# Altium schematic sheet AFE_32.SchDoc: FMC ADC 128CH 10B
size 420 x 297 mm; Author: G.Kasprowicz; CompanyName: WUT ISE; DrawnBy: G.Kasprowicz; Organization: WUT ISE; Address1: PW ISE; Address2: Nowowiejska 15/19 00-665 Warsaw; Address3: gkasprow@gmail.com; DocumentNumber: 2; Revision: 1; SheetNumber: 2; SheetTotal: 9; ModifiedBy: -; CheckedDate: -; Title2: AFE 32CH; DivGrp: WUT ISE; Designer: G.Kasprowicz; ModifiedDate: -; ProjectName: Sensor Box
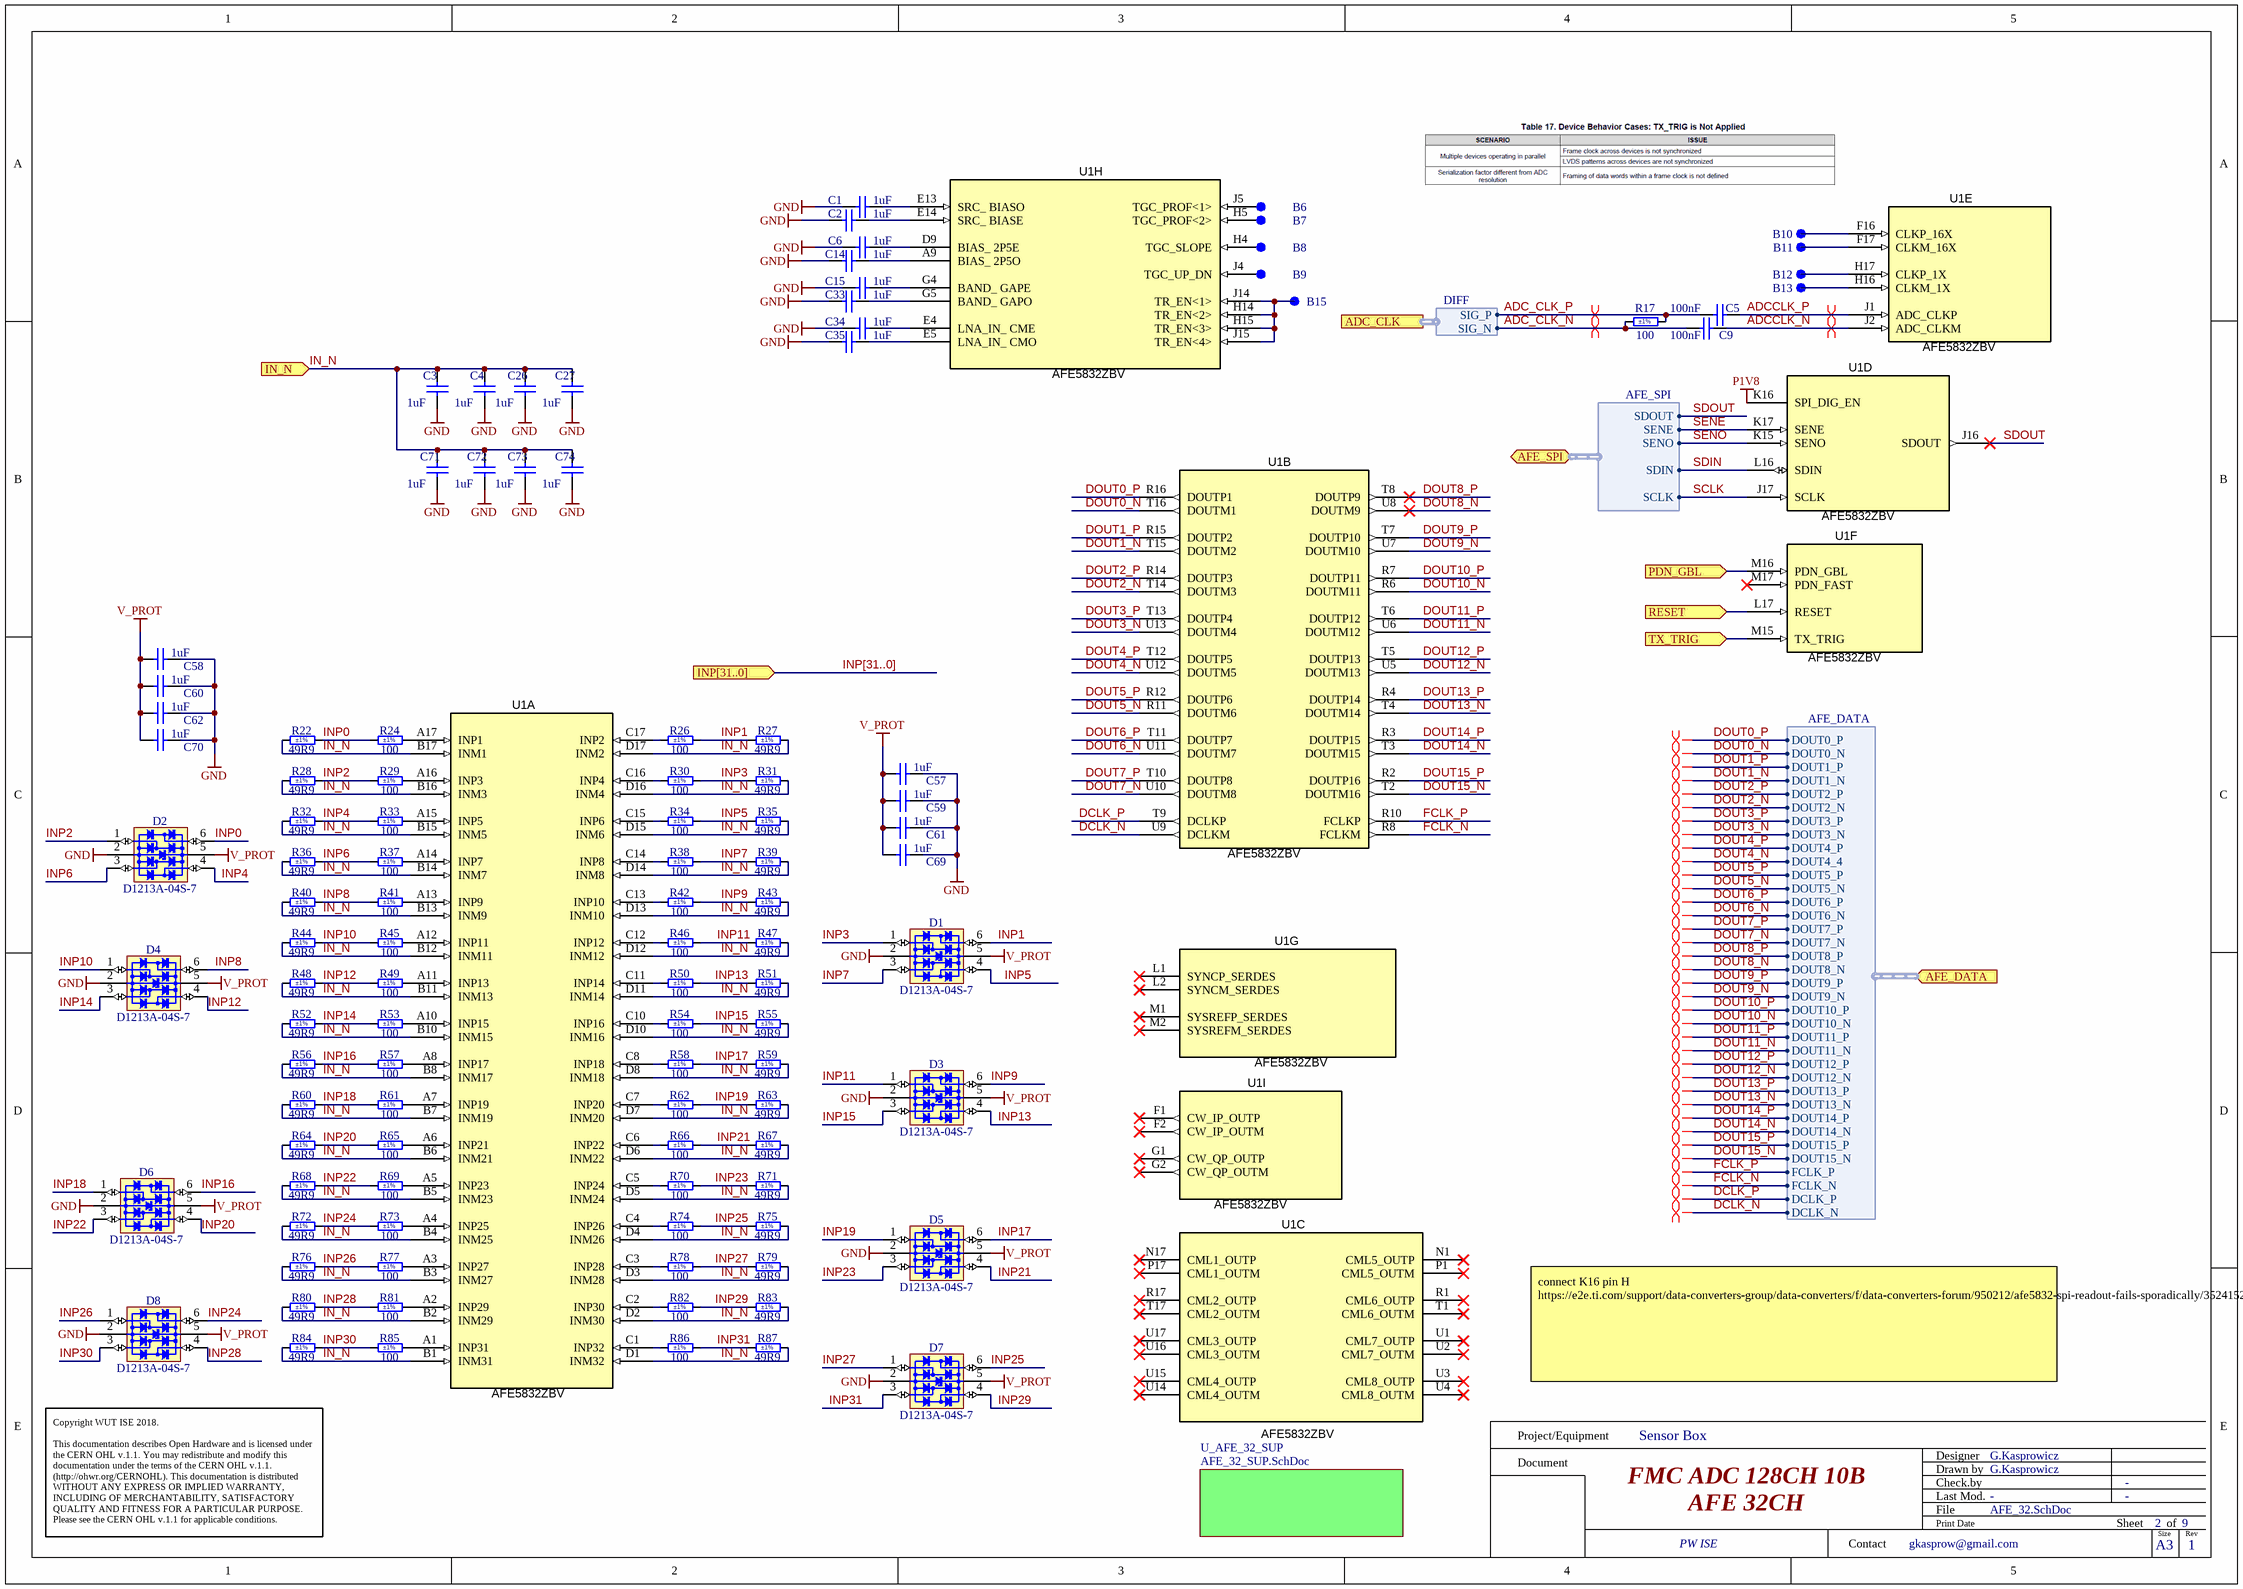
[diagram p0: AFE_32.SchDoc]

## Parts
B6  SMD Pad  [C75]  (value not drawn)  (no BOM)
B7  SMD Pad  [C75]  (value not drawn)  (no BOM)
B8  SMD Pad  [C75]  (value not drawn)  (no BOM)
B9  SMD Pad  [C75]  (value not drawn)  (no BOM)
B10  SMD Pad  [C75]  (value not drawn)  (no BOM)
B11  SMD Pad  [C75]  (value not drawn)  (no BOM)
B12  SMD Pad  [C75]  (value not drawn)  (no BOM)
B13  SMD Pad  [C75]  (value not drawn)  (no BOM)
B15  SMD Pad  [C75]  (value not drawn)  (no BOM)
C1  1uF  [CAPC1005X55N]
C2  1uF  [CAPC1005X55N]
C3  1uF  [CAPC1005X55N]
C4  1uF  [CAPC1005X55N]
C5  100nF  [CAPC0603X33N]
C6  1uF  [CAPC1005X55N]
C9  100nF  [CAPC0603X33N]
C14  1uF  [CAPC1005X55N]
C15  1uF  [CAPC1005X55N]
C26  1uF  [CAPC1005X55N]
C27  1uF  [CAPC1005X55N]
C33  1uF  [CAPC1005X55N]
C34  1uF  [CAPC1005X55N]
C35  1uF  [CAPC1005X55N]
C57  1uF  [CAPC1005X55N]
C58  1uF  [CAPC1005X55N]
C59  1uF  [CAPC1005X55N]
C60  1uF  [CAPC1005X55N]
C61  1uF  [CAPC1005X55N]
C62  1uF  [CAPC1005X55N]
C69  1uF  [CAPC1005X55N]
C70  1uF  [CAPC1005X55N]
C71  1uF  [CAPC1005X55N]
C72  1uF  [CAPC1005X55N]
C73  1uF  [CAPC1005X55N]
C74  1uF  [CAPC1005X55N]
D1  D1213A-04S-7  [SOT65P210X110-6N]
D2  D1213A-04S-7  [SOT65P210X110-6N]
D3  D1213A-04S-7  [SOT65P210X110-6N]
D4  D1213A-04S-7  [SOT65P210X110-6N]
D5  D1213A-04S-7  [SOT65P210X110-6N]
D6  D1213A-04S-7  [SOT65P210X110-6N]
D7  D1213A-04S-7  [SOT65P210X110-6N]
D8  D1213A-04S-7  [SOT65P210X110-6N]
R17  100  Tolerance: ±1%  [RESC1005X40N]
R22  49R9  Tolerance: ±1%  [RESC0603X28N]
R24  100  Tolerance: ±1%  [RESC0603X28N]
R26  100  Tolerance: ±1%  [RESC0603X28N]
R27  49R9  Tolerance: ±1%  [RESC0603X28N]
R28  49R9  Tolerance: ±1%  [RESC0603X28N]
R29  100  Tolerance: ±1%  [RESC0603X28N]
R30  100  Tolerance: ±1%  [RESC0603X28N]
R31  49R9  Tolerance: ±1%  [RESC0603X28N]
R32  49R9  Tolerance: ±1%  [RESC0603X28N]
R33  100  Tolerance: ±1%  [RESC0603X28N]
R34  100  Tolerance: ±1%  [RESC0603X28N]
R35  49R9  Tolerance: ±1%  [RESC0603X28N]
R36  49R9  Tolerance: ±1%  [RESC0603X28N]
R37  100  Tolerance: ±1%  [RESC0603X28N]
R38  100  Tolerance: ±1%  [RESC0603X28N]
R39  49R9  Tolerance: ±1%  [RESC0603X28N]
R40  49R9  Tolerance: ±1%  [RESC0603X28N]
R41  100  Tolerance: ±1%  [RESC0603X28N]
R42  100  Tolerance: ±1%  [RESC0603X28N]
R43  49R9  Tolerance: ±1%  [RESC0603X28N]
R44  49R9  Tolerance: ±1%  [RESC0603X28N]
R45  100  Tolerance: ±1%  [RESC0603X28N]
R46  100  Tolerance: ±1%  [RESC0603X28N]
R47  49R9  Tolerance: ±1%  [RESC0603X28N]
R48  49R9  Tolerance: ±1%  [RESC0603X28N]
R49  100  Tolerance: ±1%  [RESC0603X28N]
R50  100  Tolerance: ±1%  [RESC0603X28N]
R51  49R9  Tolerance: ±1%  [RESC0603X28N]
R52  49R9  Tolerance: ±1%  [RESC0603X28N]
R53  100  Tolerance: ±1%  [RESC0603X28N]
R54  100  Tolerance: ±1%  [RESC0603X28N]
R55  49R9  Tolerance: ±1%  [RESC0603X28N]
R56  49R9  Tolerance: ±1%  [RESC0603X28N]
R57  100  Tolerance: ±1%  [RESC0603X28N]
R58  100  Tolerance: ±1%  [RESC0603X28N]
R59  49R9  Tolerance: ±1%  [RESC0603X28N]
R60  49R9  Tolerance: ±1%  [RESC0603X28N]
R61  100  Tolerance: ±1%  [RESC0603X28N]
R62  100  Tolerance: ±1%  [RESC0603X28N]
R63  49R9  Tolerance: ±1%  [RESC0603X28N]
R64  49R9  Tolerance: ±1%  [RESC0603X28N]
R65  100  Tolerance: ±1%  [RESC0603X28N]
R66  100  Tolerance: ±1%  [RESC0603X28N]
R67  49R9  Tolerance: ±1%  [RESC0603X28N]
R68  49R9  Tolerance: ±1%  [RESC0603X28N]
R69  100  Tolerance: ±1%  [RESC0603X28N]
R70  100  Tolerance: ±1%  [RESC0603X28N]
R71  49R9  Tolerance: ±1%  [RESC0603X28N]
R72  49R9  Tolerance: ±1%  [RESC0603X28N]
R73  100  Tolerance: ±1%  [RESC0603X28N]
R74  100  Tolerance: ±1%  [RESC0603X28N]
R75  49R9  Tolerance: ±1%  [RESC0603X28N]
R76  49R9  Tolerance: ±1%  [RESC0603X28N]
R77  100  Tolerance: ±1%  [RESC0603X28N]
R78  100  Tolerance: ±1%  [RESC0603X28N]
R79  49R9  Tolerance: ±1%  [RESC0603X28N]
R80  49R9  Tolerance: ±1%  [RESC0603X28N]
R81  100  Tolerance: ±1%  [RESC0603X28N]
R82  100  Tolerance: ±1%  [RESC0603X28N]
R83  49R9  Tolerance: ±1%  [RESC0603X28N]
R84  49R9  Tolerance: ±1%  [RESC0603X28N]
R85  100  Tolerance: ±1%  [RESC0603X28N]
R86  100  Tolerance: ±1%  [RESC0603X28N]
R87  49R9  Tolerance: ±1%  [RESC0603X28N]
U1  AFE5832ZBV  [BGA289C80P17X17_1500X1500X140]  (parts A,B,C,D,E,F,G,H,I of 13)

## Sub-sheets
U_AFE_32_SUP = AFE_32_SUP.SchDoc: no entries

## Ports
ADC_CLK (harness DIFF), AFE_DATA (in, harness AFE_DATA), AFE_SPI (bidir, harness AFE_SPI), IN_N (in), INP[31..0] (in), PDN_GBL (in), RESET (in), TX_TRIG (in)

## Harnesses
AFE_SPI: SDOUT, SENE, SENO, SDIN, SCLK
DIFF: SIG_P, SIG_N
AFE_DATA: DOUT0_P, DOUT0_N, DOUT1_P, DOUT1_N, DOUT2_P, DOUT2_N, DOUT3_P, DOUT3_N, DOUT4_P, DOUT4_4, DOUT5_P, DOUT5_N, DOUT6_P, DOUT6_N, DOUT7_P, DOUT7_N, DOUT8_P, DOUT8_N, DOUT9_P, DOUT9_N, DOUT10_P, DOUT10_N, DOUT11_P, DOUT11_N, DOUT12_P, DOUT12_N, DOUT13_P, DOUT13_N, DOUT14_P, DOUT14_N, DOUT15_P, DOUT15_N, FCLK_P, FCLK_N, DCLK_P, DCLK_N

## Nets
GND: C1.1 C2.1 C3.2 C4.2 C6.1 C14.1 C15.1 C26.2 C27.2 C33.1 C34.1 C35.1 C57.2 C58.2 C59.2 C60.2 C61.2 C62.2 C69.2 C70.2 C71.2 C72.2 C73.2 C74.2 D1.2(GND) D2.2(GND) D3.2(GND) D4.2(GND) D5.2(GND) D6.2(GND) D7.2(GND) D8.2(GND)
P1V8: U1.K16(SPI_DIG_EN)
V_PROT: C57.1 C58.1 C59.1 C60.1 C61.1 C62.1 C69.1 C70.1 D1.5(VBUS) D2.5(VBUS) D3.5(VBUS) D4.5(VBUS) D5.5(VBUS) D6.5(VBUS) D7.5(VBUS) D8.5(VBUS)
ADC_CLK_N: C9.1 R17.1 ; port ADC_CLK.SIG_N
ADC_CLK_P: C5.1 R17.2 ; port ADC_CLK.SIG_P
ADCCLK_N: C9.2 U1.J2(ADC_CLKM)
ADCCLK_P: C5.2 U1.J1(ADC_CLKP)
DCLK_N: U1.U9(DCLKM) ; port AFE_DATA.DCLK_N
DCLK_P: U1.T9(DCLKP) ; port AFE_DATA.DCLK_P
DOUT0_N: U1.T16(DOUTM1) ; port AFE_DATA.DOUT0_N
DOUT0_P: U1.R16(DOUTP1) ; port AFE_DATA.DOUT0_P
DOUT1_N: U1.T15(DOUTM2) ; port AFE_DATA.DOUT1_N
DOUT1_P: U1.R15(DOUTP2) ; port AFE_DATA.DOUT1_P
DOUT2_N: U1.T14(DOUTM3) ; port AFE_DATA.DOUT2_N
DOUT2_P: U1.R14(DOUTP3) ; port AFE_DATA.DOUT2_P
DOUT3_N: U1.U13(DOUTM4) ; port AFE_DATA.DOUT3_N
DOUT3_P: U1.T13(DOUTP4) ; port AFE_DATA.DOUT3_P
DOUT4_N: U1.U12(DOUTM5) ; port AFE_DATA.DOUT4_4
DOUT4_P: U1.T12(DOUTP5) ; port AFE_DATA.DOUT4_P
DOUT5_N: U1.R11(DOUTM6) ; port AFE_DATA.DOUT5_N
DOUT5_P: U1.R12(DOUTP6) ; port AFE_DATA.DOUT5_P
DOUT6_N: U1.U11(DOUTM7) ; port AFE_DATA.DOUT6_N
DOUT6_P: U1.T11(DOUTP7) ; port AFE_DATA.DOUT6_P
DOUT7_N: U1.U10(DOUTM8) ; port AFE_DATA.DOUT7_N
DOUT7_P: U1.T10(DOUTP8) ; port AFE_DATA.DOUT7_P
DOUT8_N: U1.U8(DOUTM9) ; port AFE_DATA.DOUT8_N
DOUT8_P: U1.T8(DOUTP9) ; port AFE_DATA.DOUT8_P
DOUT9_N: U1.U7(DOUTM10) ; port AFE_DATA.DOUT9_N
DOUT9_P: U1.T7(DOUTP10) ; port AFE_DATA.DOUT9_P
DOUT10_N: U1.R6(DOUTM11) ; port AFE_DATA.DOUT10_N
DOUT10_P: U1.R7(DOUTP11) ; port AFE_DATA.DOUT10_P
DOUT11_N: U1.U6(DOUTM12) ; port AFE_DATA.DOUT11_N
DOUT11_P: U1.T6(DOUTP12) ; port AFE_DATA.DOUT11_P
DOUT12_N: U1.U5(DOUTM13) ; port AFE_DATA.DOUT12_N
DOUT12_P: U1.T5(DOUTP13) ; port AFE_DATA.DOUT12_P
DOUT13_N: U1.T4(DOUTM14) ; port AFE_DATA.DOUT13_N
DOUT13_P: U1.R4(DOUTP14) ; port AFE_DATA.DOUT13_P
DOUT14_N: U1.T3(DOUTM15) ; port AFE_DATA.DOUT14_N
DOUT14_P: U1.R3(DOUTP15) ; port AFE_DATA.DOUT14_P
DOUT15_N: U1.T2(DOUTM16) ; port AFE_DATA.DOUT15_N
DOUT15_P: U1.R2(DOUTP16) ; port AFE_DATA.DOUT15_P
FCLK_N: U1.R8(FCLKM) ; port AFE_DATA.FCLK_N
FCLK_P: U1.R10(FCLKP) ; port AFE_DATA.FCLK_P
IN_N: C3.1 C4.1 C26.1 C27.1 C71.1 C72.1 C73.1 C74.1 R22.2 R27.2 R28.2 R31.2 R32.2 R35.2 R36.2 R39.2 R40.2 R43.2 R44.2 R47.2 R48.2 R51.2 R52.2 R55.2 R56.2 R59.2 R60.2 R63.2 R64.2 R67.2 R68.2 R71.2 R72.2 R75.2 R76.2 R79.2 R80.2 R83.2 R84.2 R87.2 U1.B1(INM31) U1.B2(INM29) U1.B3(INM27) U1.B4(INM25) U1.B5(INM23) U1.B6(INM21) U1.B7(INM19) U1.B8(INM17) U1.B10(INM15) U1.B11(INM13) U1.B12(INM11) U1.B13(INM9) U1.B14(INM7) U1.B15(INM5) U1.B16(INM3) U1.B17(INM1) U1.D1(INM32) U1.D2(INM30) U1.D3(INM28) U1.D4(INM26) U1.D5(INM24) U1.D6(INM22) U1.D7(INM20) U1.D8(INM18) U1.D10(INM16) U1.D11(INM14) U1.D12(INM12) U1.D13(INM10) U1.D14(INM8) U1.D15(INM6) U1.D16(INM4) U1.D17(INM2) ; port IN_N
INP0: D2.6(I/O4) R22.1 R24.1
INP1: D1.6(I/O4) R26.2 R27.1
INP2: D2.1(I/O1) R28.1 R29.1
INP3: D1.1(I/O1) R30.2 R31.1
INP4: D2.4(I/O3) R32.1 R33.1
INP5: D1.4(I/O3) R34.2 R35.1
INP6: D2.3(I/O2) R36.1 R37.1
INP7: D1.3(I/O2) R38.2 R39.1
INP8: D4.6(I/O4) R40.1 R41.1
INP9: D3.6(I/O4) R42.2 R43.1
INP10: D4.1(I/O1) R44.1 R45.1
INP11: D3.1(I/O1) R46.2 R47.1
INP12: D4.4(I/O3) R48.1 R49.1
INP13: D3.4(I/O3) R50.2 R51.1
INP14: D4.3(I/O2) R52.1 R53.1
INP15: D3.3(I/O2) R54.2 R55.1
INP16: D6.6(I/O4) R56.1 R57.1
INP17: D5.6(I/O4) R58.2 R59.1
INP18: D6.1(I/O1) R60.1 R61.1
INP19: D5.1(I/O1) R62.2 R63.1
INP20: D6.4(I/O3) R64.1 R65.1
INP21: D5.4(I/O3) R66.2 R67.1
INP22: D6.3(I/O2) R68.1 R69.1
INP23: D5.3(I/O2) R70.2 R71.1
INP24: D8.6(I/O4) R72.1 R73.1
INP25: D7.6(I/O4) R74.2 R75.1
INP26: D8.1(I/O1) R76.1 R77.1
INP27: D7.1(I/O1) R78.2 R79.1
INP28: D8.4(I/O3) R80.1 R81.1
INP29: D7.4(I/O3) R82.2 R83.1
INP30: D8.3(I/O2) R84.1 R85.1
INP31: D7.3(I/O2) R86.2 R87.1
PDN_GBL: U1.M16(PDN_GBL) ; port PDN_GBL
RESET: U1.L17(RESET) ; port RESET
SCLK: U1.J17(SCLK) ; port AFE_SPI.SCLK
SDIN: U1.L16(SDIN) ; port AFE_SPI.SDIN
SDOUT: U1.J16(SDOUT) ; port AFE_SPI.SDOUT
SENE: U1.K17(SENE) ; port AFE_SPI.SENE
SENO: U1.K15(SENO) ; port AFE_SPI.SENO
TX_TRIG: U1.M15(TX_TRIG) ; port TX_TRIG
NetB6_1: B6.1 U1.J5(TGC_PROF<1>)
NetB7_1: B7.1 U1.H5(TGC_PROF<2>)
NetB8_1: B8.1 U1.H4(TGC_SLOPE)
NetB9_1: B9.1 U1.J4(TGC_UP_DN)
NetB10_1: B10.1 U1.F16(CLKP_16X)
NetB11_1: B11.1 U1.F17(CLKM_16X)
NetB12_1: B12.1 U1.H17(CLKP_1X)
NetB13_1: B13.1 U1.H16(CLKM_1X)
NetB15_1: B15.1 U1.H14(TR_EN<2>) U1.H15(TR_EN<3>) U1.J14(TR_EN<1>) U1.J15(TR_EN<4>)
NetC1_2: C1.2 U1.E13(SRC__BIASO)
NetC2_2: C2.2 U1.E14(SRC__BIASE)
NetC6_2: C6.2 U1.D9(BIAS__2P5E)
NetC14_2: C14.2 U1.A9(BIAS__2P5O)
NetC15_2: C15.2 U1.G4(BAND__GAPE)
NetC33_2: C33.2 U1.G5(BAND__GAPO)
NetC34_2: C34.2 U1.E4(LNA_IN__CME)
NetC35_2: C35.2 U1.E5(LNA_IN__CMO)
NetR24_2: R24.2 U1.A17(INP1)
NetR26_1: R26.1 U1.C17(INP2)
NetR29_2: R29.2 U1.A16(INP3)
NetR30_1: R30.1 U1.C16(INP4)
NetR33_2: R33.2 U1.A15(INP5)
NetR34_1: R34.1 U1.C15(INP6)
NetR37_2: R37.2 U1.A14(INP7)
NetR38_1: R38.1 U1.C14(INP8)
NetR41_2: R41.2 U1.A13(INP9)
NetR42_1: R42.1 U1.C13(INP10)
NetR45_2: R45.2 U1.A12(INP11)
NetR46_1: R46.1 U1.C12(INP12)
NetR49_2: R49.2 U1.A11(INP13)
NetR50_1: R50.1 U1.C11(INP14)
NetR53_2: R53.2 U1.A10(INP15)
NetR54_1: R54.1 U1.C10(INP16)
NetR57_2: R57.2 U1.A8(INP17)
NetR58_1: R58.1 U1.C8(INP18)
NetR61_2: R61.2 U1.A7(INP19)
NetR62_1: R62.1 U1.C7(INP20)
NetR65_2: R65.2 U1.A6(INP21)
NetR66_1: R66.1 U1.C6(INP22)
NetR69_2: R69.2 U1.A5(INP23)
NetR70_1: R70.1 U1.C5(INP24)
NetR73_2: R73.2 U1.A4(INP25)
NetR74_1: R74.1 U1.C4(INP26)
NetR77_2: R77.2 U1.A3(INP27)
NetR78_1: R78.1 U1.C3(INP28)
NetR81_2: R81.2 U1.A2(INP29)
NetR82_1: R82.1 U1.C2(INP30)
NetR85_2: R85.2 U1.A1(INP31)
NetR86_1: R86.1 U1.C1(INP32)

Not connected (* = marked no-connect by the designer): U1 F1(CW_IP_OUTP)* F2(CW_IP_OUTM)* G1(CW_QP_OUTP)* G2(CW_QP_OUTM)* L1(SYNCP_SERDES)* L2(SYNCM_SERDES)* M1(SYSREFP_SERDES)* M2(SYSREFM_SERDES)* M17(PDN_FAST)* N1(CML5_OUTP)* N17(CML1_OUTP)* P1(CML5_OUTM)* P17(CML1_OUTM)* R1(CML6_OUTP)* R17(CML2_OUTP)* T1(CML6_OUTM)* T17(CML2_OUTM)* U1(CML7_OUTP)* U2(CML7_OUTM)* U3(CML8_OUTP)* U4(CML8_OUTM)* U14(CML4_OUTM)* U15(CML4_OUTP)* U16(CML3_OUTM)* U17(CML3_OUTP)*

## Buses and harness runs
bus INP[31..0] = port INP[31..0]

## Layout directives
differential pair: ADC_CLK_N, ADC_CLK_P, ADCCLK_N, ADCCLK_P, DCLK_N, DCLK_P, DOUT0_N, DOUT0_P, DOUT1_N, DOUT1_P, DOUT2_N, DOUT2_P, DOUT3_N, DOUT3_P, DOUT4_N, DOUT4_P, DOUT5_N, DOUT5_P, DOUT6_N, DOUT6_P, DOUT7_N, DOUT7_P, DOUT8_N, DOUT8_P, DOUT9_N, DOUT9_P, DOUT10_N, DOUT10_P, DOUT11_N, DOUT11_P, DOUT12_N, DOUT12_P, DOUT13_N, DOUT13_P, DOUT14_N, DOUT14_P, DOUT15_N, DOUT15_P, FCLK_N, FCLK_P

## Notes on the sheet
- connect K16 pin H
  https://e2e.ti.com/support/data-converters-group/data-converters/f/data-converters-forum/950212/afe5832-spi-readout-fails-sporadically/3524152?tisearch=e2e-sitesearch&keymatch=AFE5832#3524152
- Project/Equipment
- Document
- Designer
- Drawn by
- Check.by
- Copyright WUT ISE 2018.
  This documentation describes Open Hardware and is licensed under the CERN OHL v.1.1. You may redistribute and modify this documentation under the terms of the CERN OHL v.1.1. (http://ohwr.org/CERNOHL). This documentation is distributed WITHOUT ANY EXPRESS OR IMPLIED WARRANTY, INCLUDING OF MERCHANTABILITY, SATISFACTORY QUALITY AND FITNESS FOR A PARTICULAR PURPOSE. Please see the CERN OHL v.1.1 for applicable conditions.
- Contact
- File
- Last Mod.
- Print Date
- Sheet
- Size
- A3
- of
- Rev

## Library data of the parts
B6-B13 B15 = SMD_PAD_D0.75MM: Through Hole Pad; Part Description: 0.75mm Diameter SMD Pad; Mounted: No; Part Number: SMD_PAD_D0.75MM; Component Type: Standard (No BOM); Pin Count: 1; Family: SMD Pad; Socket: No; SMD: No; Sense: No; Status: None; ComponentHeight: 0mm; HelpURL: Undefined; Author: CERN DEM BC; CreateDate: 04.06.2020; LatestRevisionDate: 04.06.2020; PackageDescription: 0.75mm Diameter SMD Pad
C1-C4 C6 C14 C15 C26 C27 C33-C35 C57-C62 C69-C74 = CC0402_1UF_25V_10%_X5R: Non-polarised capacitor; Part Description: SMD Multilayer Chip Ceramic Capacitor; Manufacturer: GENERIC; Manufacturer1 Part Number: C1005X5R1E105K050; Voltage: 25V; TC: X5R; Tolerance: ±10%; Part Number: CC0402_1UF_25V_10%_X5R; Component Kind: Standard; Component Type: Standard; Pin Count: 2; Value: 1uF; Status: Preferred; Manufacturer Part Number: CC0402_1UF_25V_10%_X5R; Case: 0402; Mounted: Yes; Socket: No; SMD: Yes; Sense: No; Manufacturer1 Example: TDK; Manufacturer1 ComponentHeight: 0.55mm; HelpURL: \\cern.ch\dfs\Applications\Altium\Datasheets\CC0402_X5R_TDK_C.pdf; Author: CERN DEM BC; CreateDate: 17.02.2020; LatestRevisionDate: 17.02.2020
C5 C9 = CC0201_100NF_6.3V_10%_X5R: Non-polarised capacitor; Part Description: SMD Multilayer Chip Ceramic Capacitor; Manufacturer: GENERIC; Manufacturer1 Part Number: 02016D104KAT2A; Voltage: 6.3V; TC: X5R; Tolerance: ±10%; Part Number: CC0201_100NF_6.3V_10%_X5R; Component Kind: Standard; Component Type: Standard; Pin Count: 2; Value: 100nF; Status: Not Recommended; Manufacturer Part Number: CC0201_100NF_6.3V_10%_X5R; Case: 0201; Mounted: Yes; Socket: No; SMD: Yes; Sense: No; Manufacturer1 Example: AVX; Manufacturer1 ComponentHeight: 0.33mm; HelpURL: \\cern.ch\dfs\Applications\Altium\Datasheets\CC0201_X5R_AVX.pdf; Author: CERN DEM JLC; CreateDate: 03.12.2007; LatestRevisionDate: 03.12.2007
D1-D8 = D_TVS_D1213A-04S-7: Integrated Quad Ultra-Low Capacitance ESD Protection; Part Description: Integrated Quad Ultra-Low Capacitance ESD (±8kV) Protection; Manufacturer: DIODES; PressFit: No; Bonding: No; Status Comment: Active; Part Number: D1213A-04S-7; Component Kind: Standard; Component Type: Standard; Device: D1213A-04S-7; PackageDescription: SOT363, SC70-6, 0.65mm Pitch; 6 Pin, 1.25mm W X 2.00mm L X 1.10mm H body, IPC Medium Density; Status: Active; Manufacturer Part Number: D1213A-04S-7; Pin Count: 6; Case: SOT363; Mounted: Yes; Socket: No; SMD: Yes; Sense: No; ComponentHeight: 1.1mm; HelpURL: \\cern.ch\dfs\Applications\Altium\Datasheets\PRTR5V0U4Y.pdf; Author: GK; CreateDate: 24.01.2017; LatestRevisionDate: 14.09.2020
R17 = R0402_100R_1%_0.0625W_100PPM: Resistor - 1%; Part Description: General Purpose Thick Film Chip Resistor; Manufacturer: GENERIC; Manufacturer1 Part Number: 232270671001L; TC: ±100ppm/°C; PressFit: No; Part Number: R0402_100R_1%_0.0625W_100PPM; Component Kind: Standard; Component Type: Standard; Pin Count: 2; Value: 100; Status: Not Recommended; Power: 0.0625W; Manufacturer Part Number: R0402_100R_1%_0.0625W_100PPM; Case: 0402; Mounted: Yes; Sense: No; Socket: No; SMD: Yes; Manufacturer1 Example: YAGEO PHYCOMP; Manufacturer1 ComponentHeight: 0.4mm; HelpURL: \\cern.ch\dfs\Applications\Altium\Datasheets\R0402_Phycomp_RC0402.pdf; Author: CERN DEM JLC; CreateDate: 03.12.2007; LatestRevisionDate: 17.10.2012
R22 R27 R28 R31 R32 R35 R36 R39 R40 R43 R44 R47 R48 R51 R52 R55 R56 R59 R60 R63 R64 R67 R68 R71 R72 R75 R76 R79 R80 R83 R84 R87 = R0201_49R9_1%_0.05W_200PPM: Resistor - 1%; Part Description: Thick Film Chip Resistor; Manufacturer: GENERIC; Manufacturer1 Part Number: CRCW020149R9FNED; Power: 0.05W; TC: ±200ppm/°C; PressFit: No; Part Number: R0201_49R9_1%_0.05W_200PPM; Component Kind: Standard; Component Type: Standard; Pin Count: 2; Value: 49R9; Status: Not Recommended; Manufacturer Part Number: R0201_49R9_1%_0.05W_200PPM; Case: 0201; Mounted: Yes; Sense: No; Socket: No; SMD: Yes; Manufacturer1 Example: VISHAY; Manufacturer1 ComponentHeight: 0.27mm; HelpURL: \\cern.ch\dfs\Applications\Altium\Datasheets\R0201_VISHAY_CRCW e3.pdf; Author: CERN DEM BC; CreateDate: 10.01.2020; LatestRevisionDate: 10.01.2020
R24 R26 R29 R30 R33 R34 R37 R38 R41 R42 R45 R46 R49 R50 R53 R54 R57 R58 R61 R62 R65 R66 R69 R70 R73 R74 R77 R78 R81 R82 R85 R86 = R0201_100R_1%_0.05W_200PPM: Resistor - 1%; Part Description: Thick Film Chip Resistor; Manufacturer: GENERIC; Manufacturer1 Part Number: CRCW0201100RFNED; Power: 0.05W; TC: ±200ppm/°C; PressFit: No; Part Number: R0201_100R_1%_0.05W_200PPM; Component Kind: Standard; Component Type: Standard; Pin Count: 2; Value: 100; Status: Not Recommended; Manufacturer Part Number: R0201_100R_1%_0.05W_200PPM; Case: 0201; Mounted: Yes; Sense: No; Socket: No; SMD: Yes; Manufacturer1 Example: VISHAY; Manufacturer1 ComponentHeight: 0.27mm; HelpURL: \\cern.ch\dfs\Applications\Altium\Datasheets\R0201_VISHAY_CRCW e3.pdf; Author: CERN DEM JLC; CreateDate: 13.11.2014; LatestRevisionDate: 13.11.2014
U1 = AFE58JD32ZBV: 32-Channel Ultrasound AFE with 41.5-mW/Channel Power, 1.5nV/√Hz Noise, 12-Bit, 40-MSPS or 10-Bit, 50-MSPS output and Passive CW Mixer, ZBV0289A (NFBGA-289); Manufacturer: Texas Instruments; SymbolCreator: Altium; SizeArea_mm2: 225; SizeAreaWB_mm2: 289; SizeX_mm: 15; SizeZ_mm: 1.8; CompType: IC; U/M: EA; SymbolVersion: 2017-06-05; PartNumber: AFE5832ZBV; PackageReference: ZBV0289A; PackageDescription: NFBGA-289; MountType: SMT; SizeY_mm: 15; ComponentLink1Description: Datasheet Link; ComponentLink1URL: https://sps06.itg.ti.com/sites/KMS/crossdivteams/altium/docs/ComponentDatasheets/AFE58JD32_Rev1.2.pdf; Publisher: Texas Instruments; LatestRevisionDate: 2017-06-06; Alternate Manufacturer: Texas Instruments